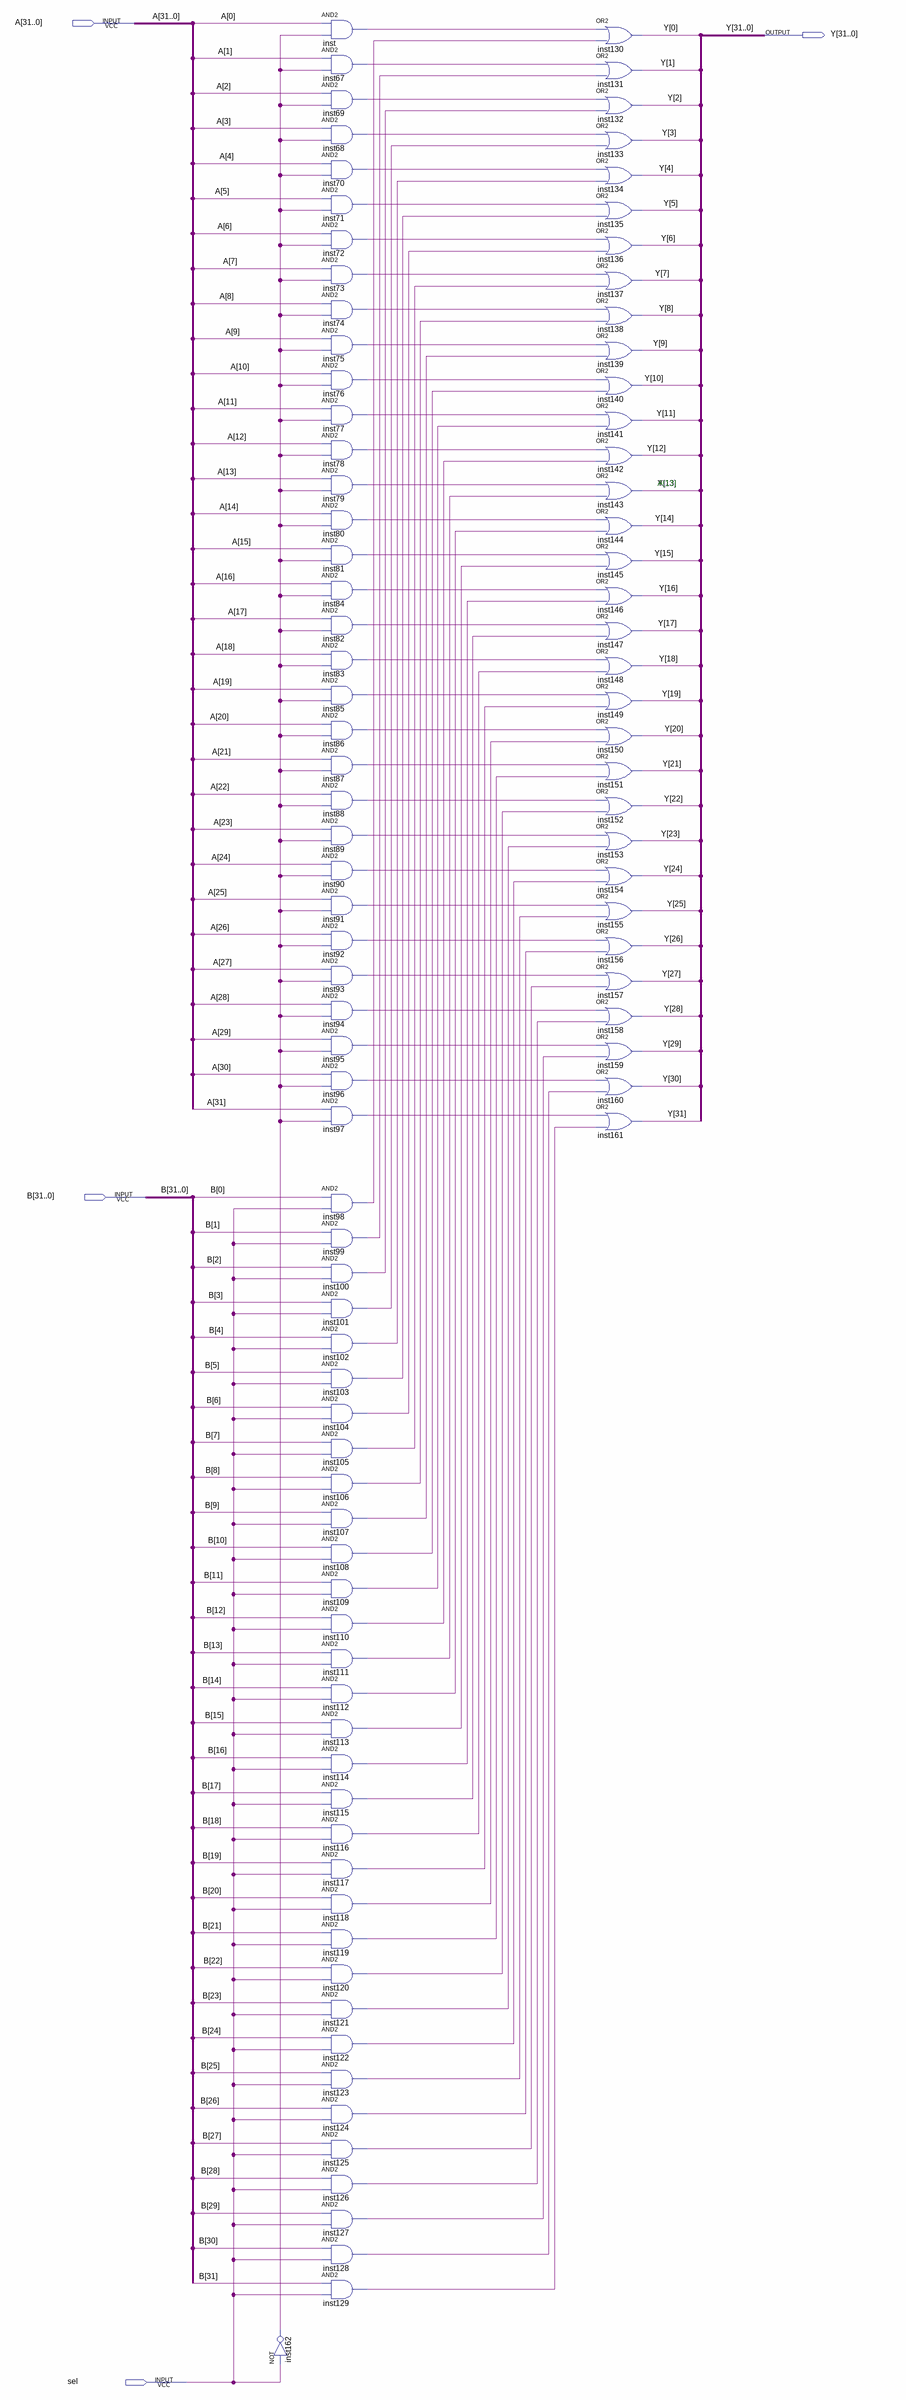
[diagram p0: schematic sheet]
// Quartus schematic 64sel32.bdf as structural Verilog: 97 symbols, 4 pins
module \64sel32  (
  input  [31:0] A,
  input  [31:0] B,
  input  sel,
  output [31:0] Y
);

  wire inst67_out, inst68_out, inst69_out, inst70_out, inst71_out, inst72_out, inst73_out, inst74_out,
       inst75_out, inst76_out, inst77_out, inst78_out, inst79_out, inst80_out, inst81_out, inst82_out,
       inst83_out, inst84_out, inst85_out, inst86_out, inst87_out, inst88_out, inst89_out, inst90_out,
       inst91_out, inst92_out, inst93_out, inst94_out, inst95_out, inst96_out, inst97_out, inst98_out,
       inst99_out, inst100_out, inst101_out, inst102_out, inst103_out, inst104_out, inst105_out, inst106_out,
       inst107_out, inst108_out, inst109_out, inst110_out, inst111_out, inst112_out, inst113_out,
       inst114_out, inst115_out, inst116_out, inst117_out, inst118_out, inst119_out, inst120_out,
       inst121_out, inst122_out, inst123_out, inst124_out, inst125_out, inst126_out, inst127_out,
       inst128_out, inst129_out, inst162_out, inst_out;

  not inst162 (inst162_out, sel);
  and inst (inst_out, A[0], inst162_out);
  and inst67 (inst67_out, A[1], inst162_out);
  and inst69 (inst69_out, A[2], inst162_out);
  and inst68 (inst68_out, A[3], inst162_out);
  and inst70 (inst70_out, A[4], inst162_out);
  and inst71 (inst71_out, A[5], inst162_out);
  and inst72 (inst72_out, A[6], inst162_out);
  and inst73 (inst73_out, A[7], inst162_out);
  and inst74 (inst74_out, A[8], inst162_out);
  and inst75 (inst75_out, A[9], inst162_out);
  and inst76 (inst76_out, A[10], inst162_out);
  and inst77 (inst77_out, A[11], inst162_out);
  and inst78 (inst78_out, A[12], inst162_out);
  and inst79 (inst79_out, A[13], inst162_out);
  and inst80 (inst80_out, A[14], inst162_out);
  and inst81 (inst81_out, A[15], inst162_out);
  and inst84 (inst84_out, A[16], inst162_out);
  and inst82 (inst82_out, A[17], inst162_out);
  and inst83 (inst83_out, A[18], inst162_out);
  and inst85 (inst85_out, A[19], inst162_out);
  and inst86 (inst86_out, A[20], inst162_out);
  and inst87 (inst87_out, A[21], inst162_out);
  and inst88 (inst88_out, A[22], inst162_out);
  and inst89 (inst89_out, A[23], inst162_out);
  and inst90 (inst90_out, A[24], inst162_out);
  and inst91 (inst91_out, A[25], inst162_out);
  and inst92 (inst92_out, A[26], inst162_out);
  and inst93 (inst93_out, A[27], inst162_out);
  and inst94 (inst94_out, A[28], inst162_out);
  and inst95 (inst95_out, A[29], inst162_out);
  and inst96 (inst96_out, A[30], inst162_out);
  and inst97 (inst97_out, A[31], inst162_out);
  and inst98 (inst98_out, B[0], sel);
  and inst99 (inst99_out, B[1], sel);
  and inst100 (inst100_out, B[2], sel);
  and inst101 (inst101_out, B[3], sel);
  and inst102 (inst102_out, B[4], sel);
  and inst103 (inst103_out, B[5], sel);
  and inst104 (inst104_out, B[6], sel);
  and inst105 (inst105_out, B[7], sel);
  and inst106 (inst106_out, B[8], sel);
  and inst107 (inst107_out, B[9], sel);
  and inst108 (inst108_out, B[10], sel);
  and inst109 (inst109_out, B[11], sel);
  and inst110 (inst110_out, B[12], sel);
  and inst111 (inst111_out, B[13], sel);
  and inst112 (inst112_out, B[14], sel);
  and inst113 (inst113_out, B[15], sel);
  and inst114 (inst114_out, B[16], sel);
  and inst115 (inst115_out, B[17], sel);
  and inst116 (inst116_out, B[18], sel);
  and inst117 (inst117_out, B[19], sel);
  and inst118 (inst118_out, B[20], sel);
  and inst119 (inst119_out, B[21], sel);
  and inst120 (inst120_out, B[22], sel);
  and inst121 (inst121_out, B[23], sel);
  and inst122 (inst122_out, B[24], sel);
  and inst123 (inst123_out, B[25], sel);
  and inst124 (inst124_out, B[26], sel);
  and inst125 (inst125_out, B[27], sel);
  and inst126 (inst126_out, B[28], sel);
  and inst127 (inst127_out, B[29], sel);
  and inst128 (inst128_out, B[30], sel);
  and inst129 (inst129_out, B[31], sel);
  or inst130 (Y[0], inst_out, inst98_out);
  or inst131 (Y[1], inst67_out, inst99_out);
  or inst132 (Y[2], inst69_out, inst100_out);
  or inst133 (Y[3], inst68_out, inst101_out);
  or inst134 (Y[4], inst70_out, inst102_out);
  or inst135 (Y[5], inst71_out, inst103_out);
  or inst136 (Y[6], inst72_out, inst104_out);
  or inst137 (Y[7], inst73_out, inst105_out);
  or inst138 (Y[8], inst74_out, inst106_out);
  or inst139 (Y[9], inst75_out, inst107_out);
  or inst140 (Y[10], inst76_out, inst108_out);
  or inst141 (Y[11], inst77_out, inst109_out);
  or inst142 (Y[12], inst78_out, inst110_out);
  or inst143 (Y[13], inst79_out, inst111_out);
  or inst144 (Y[14], inst80_out, inst112_out);
  or inst145 (Y[15], inst81_out, inst113_out);
  or inst146 (Y[16], inst84_out, inst114_out);
  or inst147 (Y[17], inst82_out, inst115_out);
  or inst148 (Y[18], inst83_out, inst116_out);
  or inst149 (Y[19], inst85_out, inst117_out);
  or inst150 (Y[20], inst86_out, inst118_out);
  or inst151 (Y[21], inst87_out, inst119_out);
  or inst152 (Y[22], inst88_out, inst120_out);
  or inst153 (Y[23], inst89_out, inst121_out);
  or inst154 (Y[24], inst90_out, inst122_out);
  or inst155 (Y[25], inst91_out, inst123_out);
  or inst156 (Y[26], inst92_out, inst124_out);
  or inst157 (Y[27], inst93_out, inst125_out);
  or inst158 (Y[28], inst94_out, inst126_out);
  or inst159 (Y[29], inst95_out, inst127_out);
  or inst160 (Y[30], inst96_out, inst128_out);
  or inst161 (Y[31], inst97_out, inst129_out);

  // Notes on the sheet:
  //   A[13]
endmodule
